# Altium schematic sheet trace_8.SchDoc
size A4; SheetNumber: 1; SheetTotal: 1
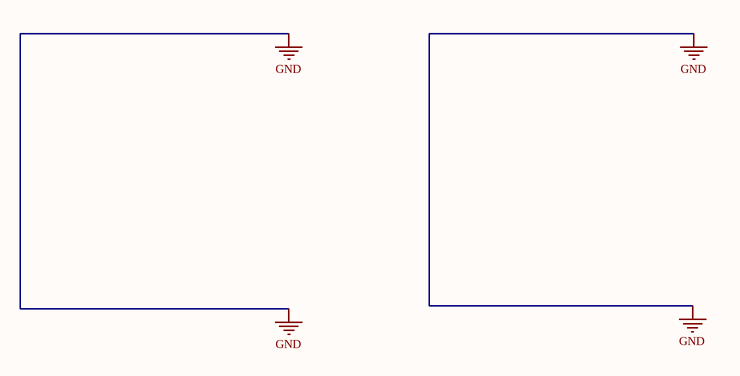
[diagram p0: trace_8.SchDoc]

## Notes on the sheet
- TITLE:
- DOCUMENT NAME:
- AUTHOR :
- REVIEWER:
- This document is created by/ for Mitai. Any further questions can be asked through
- Sheet
- PART NO.:
- of
- DATE:
- *
- TEMPLATE:
- team@mitai.ai.
- A4
- Contact Address:Rosenheimer Straße 116b,81669, München.